# Altium schematic sheet [TOP-PAGE]-BASEPROJECT.SchDoc: Cover Page
size A3; Ingenieur: Stephan Diel; Address1: Straße Nr x; Address2: xxxx Ort; Address3: Germany; Address4: www.xxxxx.de; DocumentNumber: 13; Revision: V1I1; SheetNumber: 13; SheetTotal: 13; NavArtikelnummern: xxxxx
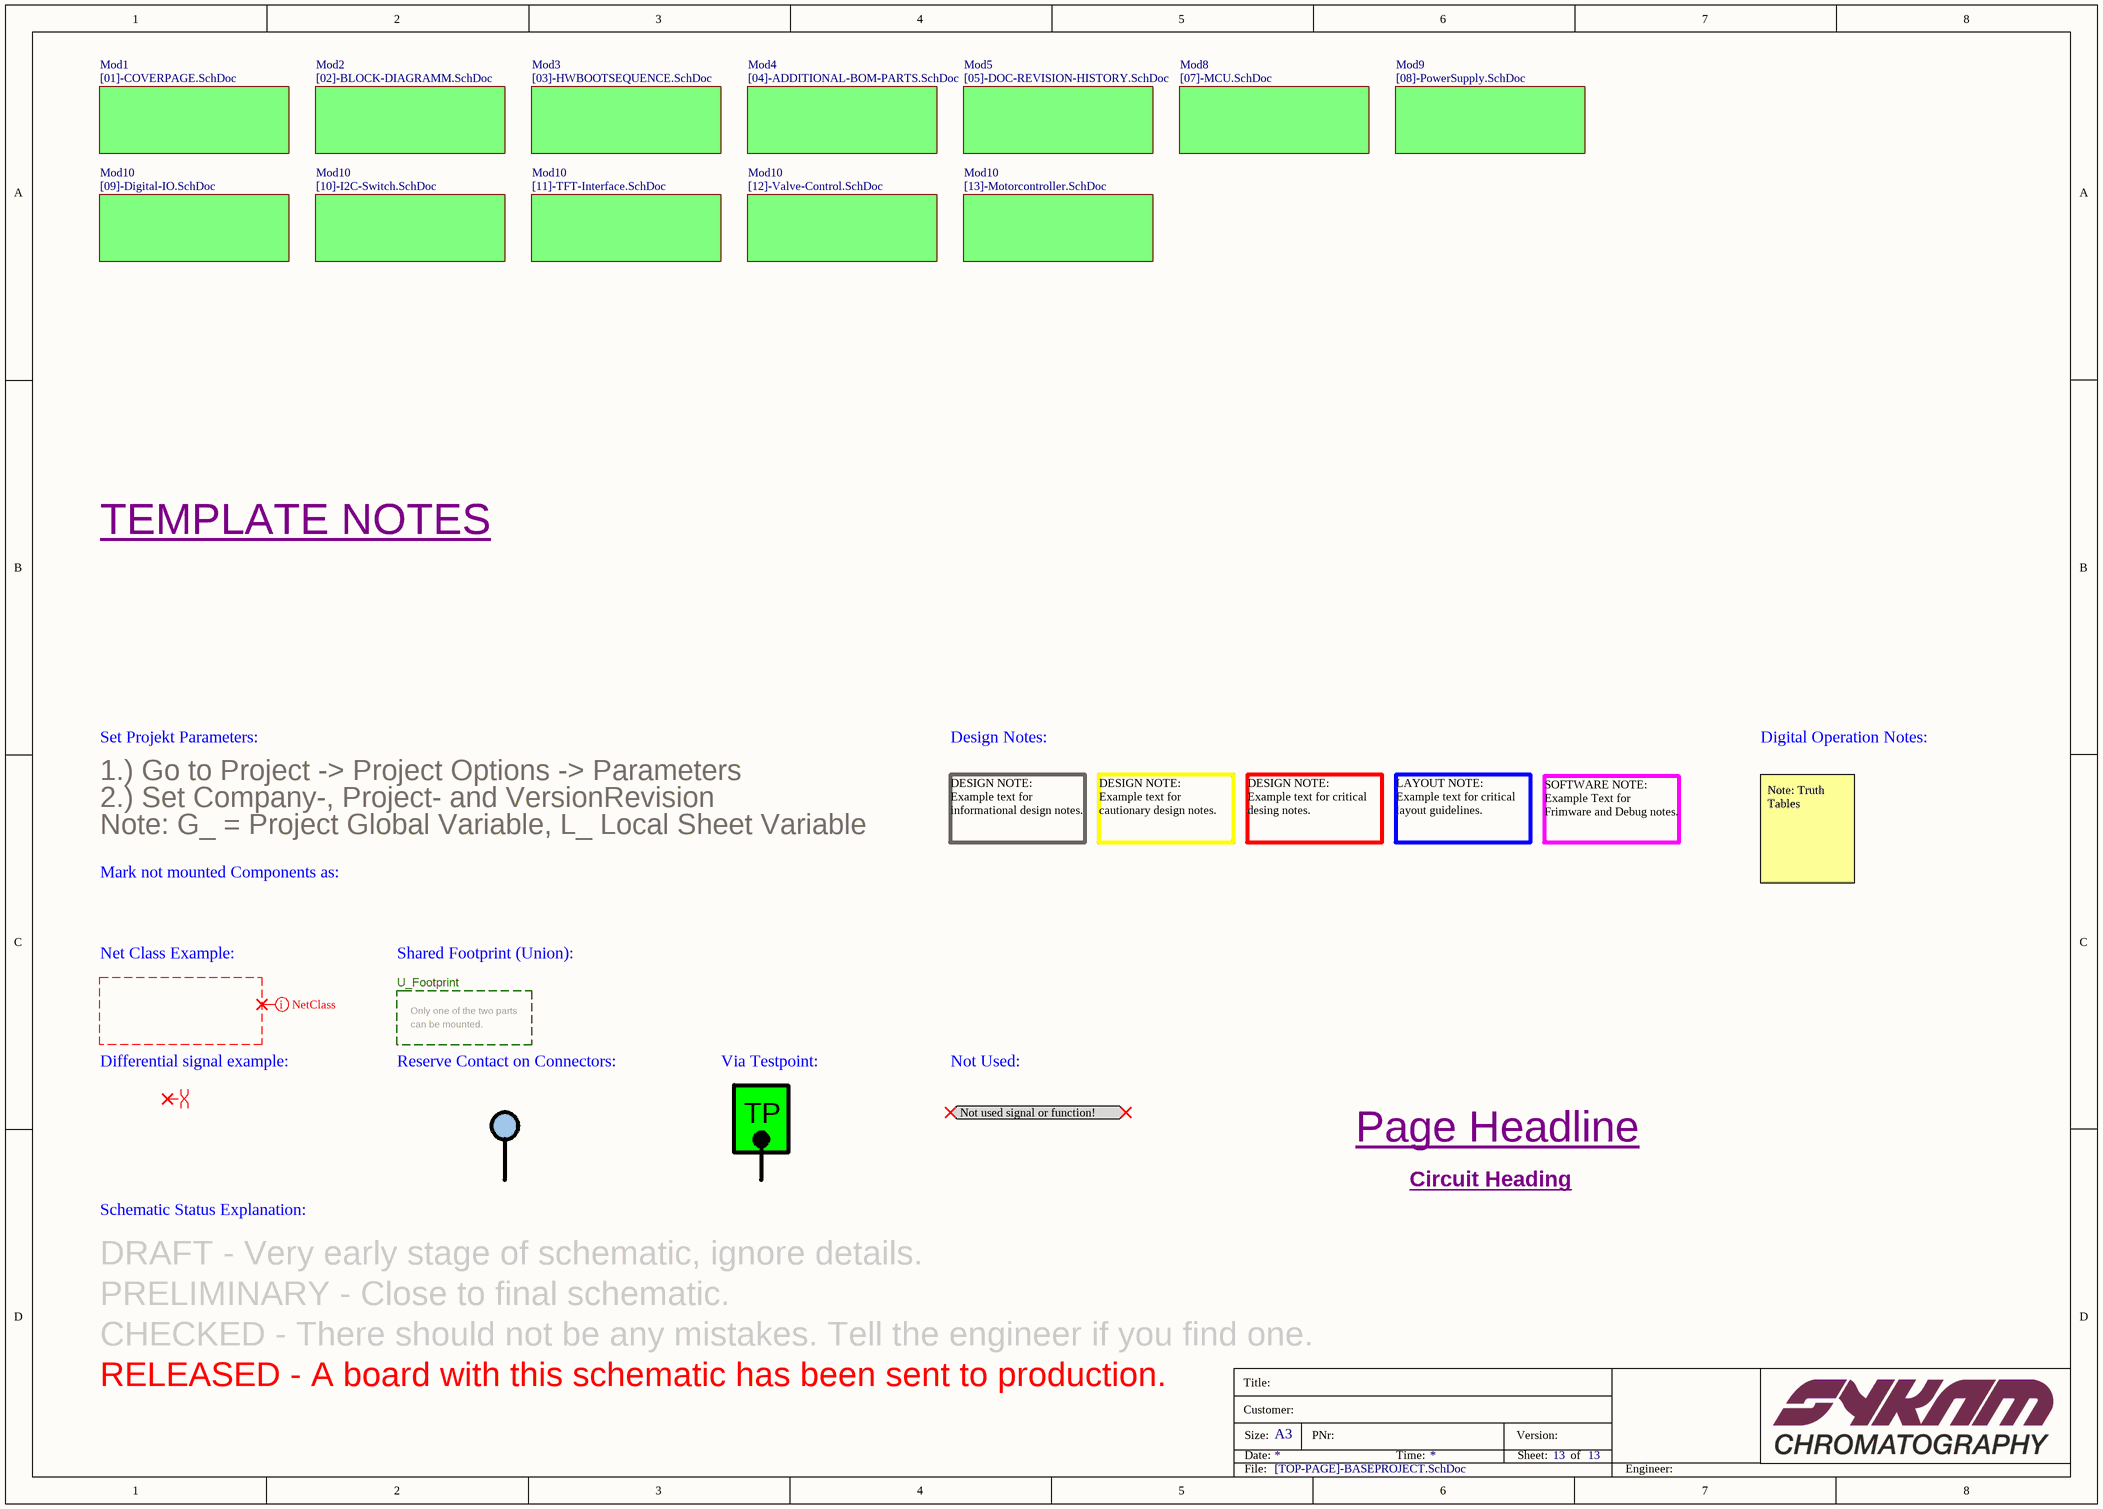
[diagram p0: [TOP-PAGE]-BASEPROJECT.SchDoc]

## Sub-sheets
Mod1 = [01]-COVERPAGE.SchDoc: no entries
Mod2 = [02]-BLOCK-DIAGRAMM.SchDoc: no entries
Mod3 = [03]-HWBOOTSEQUENCE.SchDoc: no entries
Mod4 = [04]-ADDITIONAL-BOM-PARTS.SchDoc: no entries
Mod5 = [05]-DOC-REVISION-HISTORY.SchDoc: no entries
Mod8 = [07]-MCU.SchDoc: no entries
Mod9 = [08]-PowerSupply.SchDoc: no entries
Mod10 = [09]-Digital-IO.SchDoc: no entries
Mod10 = [10]-I2C-Switch.SchDoc: no entries
Mod10 = [11]-TFT-Interface.SchDoc: no entries
Mod10 = [12]-Valve-Control.SchDoc: no entries
Mod10 = [13]-Motorcontroller.SchDoc: no entries

## Ports
Not used signal or function! (bidir)

## Layout directives
mark named NetClass: (no net found under the mark)
differential pair: (no net found under the mark)

## Notes on the sheet
- TEMPLATE NOTES
- Set Projekt Parameters:
- 1.) Go to Project -> Project Options -> Parameters
- Design Notes:
- Digital Operation Notes:
- 2.) Set Company-, Project- and VersionRevision
- Note: G_ = Project Global Variable, L_ Local Sheet Variable
- DESIGN NOTE:
  Example text for informational design notes.
- DESIGN NOTE:
  Example text for cautionary design notes.
- DESIGN NOTE:
  Example text for critical desing notes.
- LAYOUT NOTE:
  Example text for critical layout guidelines.
- SOFTWARE NOTE:
  Example Text for Frimware and Debug notes.
- Mark not mounted Components as:
- Note: Truth Tables
- Net Class Example:
- U_Footprint
- Shared Footprint (Union):
- Only one of the two parts
- can be mounted.
- Differential signal example:
- Reserve Contact on Connectors:
- Via Testpoint:
- TP
- Not Used:
- Page Headline
- Circuit Heading
- Schematic Status Explanation:
- DRAFT - Very early stage of schematic, ignore details.
- PRELIMINARY - Close to final schematic.
- CHECKED - There should not be any mistakes. Tell the engineer if you find one.
- RELEASED - A board with this schematic has been sent to production.
- Title:
- Customer:
- Size:
- Date:
- A3
- PNr:
- Time:
- Version:
- Sheet:
- of
- File:
- Engineer: